# EAGLE schematic PSU (EAGLE 9.2.2)
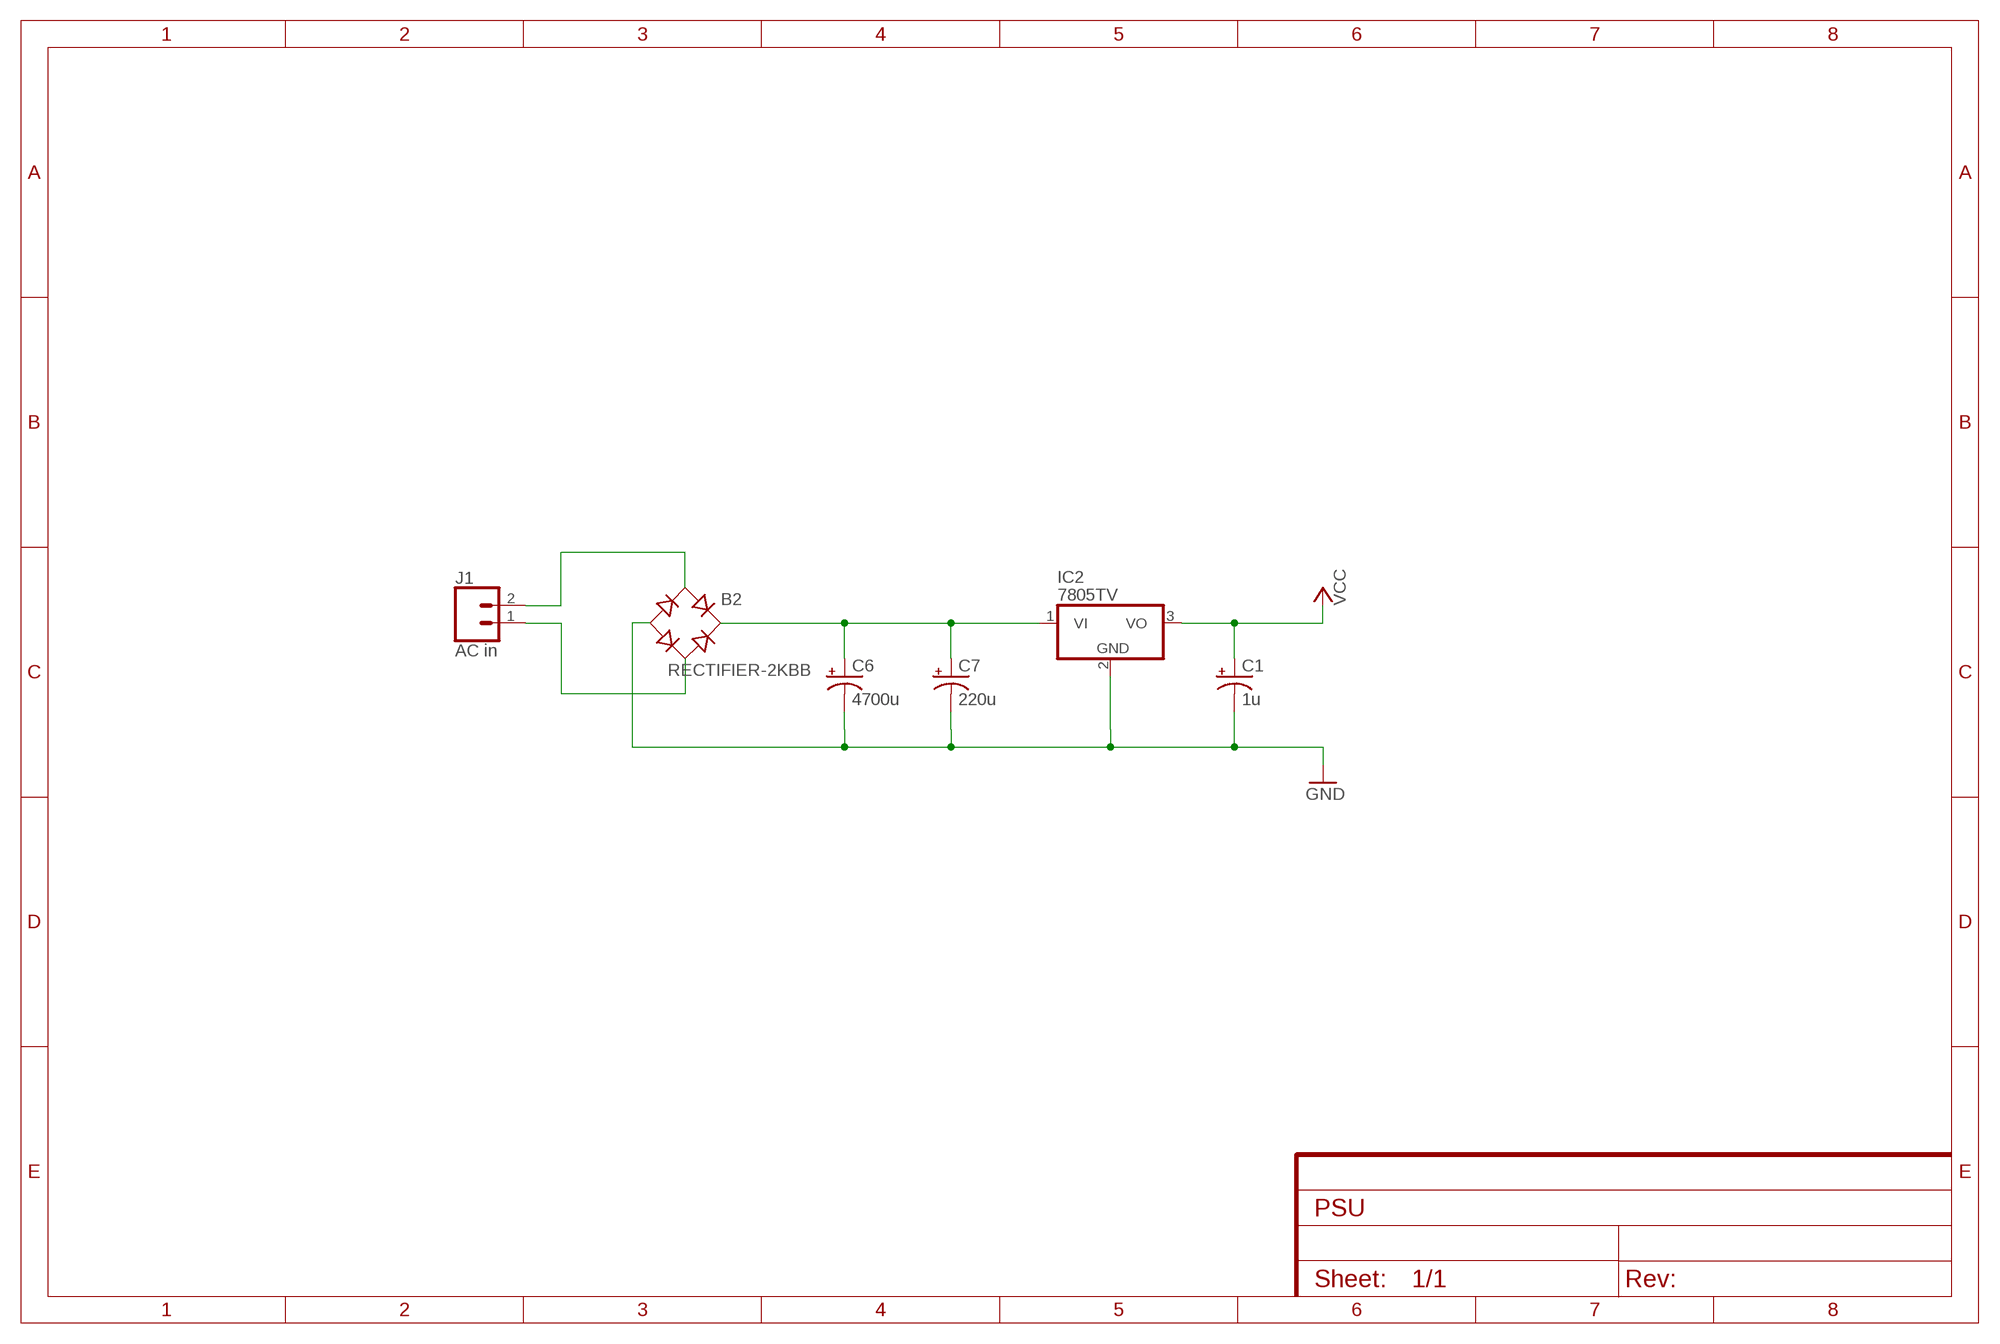
[diagram p0: schematic, sheet 1]

## Parts
B2  RECTIFIER-2KBB  [2KBB]
C1  1u  CPOL-USE2.5-5  [E2,5-5]
C6  4700u  CPOL-USE7.5-16  [E7,5-16]
C7  220u  CPOL-USE2.5-6  [E2,5-6]
IC2  7805TV  [TO220V]
J1  AC in  CONN_02  [1X02]

## Nets
GND [power]: B2.- C1.- C6.- C7.- IC2.2(GND)
N$105 [power]: B2.AC1 J1.2
N$107 [power]: B2.AC2 J1.1
N$108 [power]: B2.+ C6.+ C7.+ IC2.1(VI)
VCC [power]: C1.+ IC2.3(VO)

## Library data of the parts
B2 = rectifier:RECTIFIER-: Rectifier
C1 C6 C7 = adafruit:CPOL-US: POLARIZED CAPACITOR, American symbol
IC2 = linear:78*: Positive VOLTAGE REGULATOR Source: http://cache.national.com/ds/LM/LM78L05.pdf http://www.fairchildsemi.com/ds/LM/LM7805.pdf
J1 = SparkFun-Connectors:CONN_02: Multi connection point. Often used as Generic Header-pin footprint for 0.1 inch spaced/style header connections On any of the 0.1 inch spaced packages, you can populate with these: Break Away Headers - Straight <https://www.sparkfun.com/products/116> (PRT-00116) Break Away Male Headers - Right Angle <https://www.sparkfun.com/products/553> (PRT-00553) Female Headers <https://www.sparkfun.com/products/115> (PRT-00115) Break Away Headers - Machine Pin <https://www.sparkfun.com/products/117> (PRT-00117) Break Away Female Headers - Swiss Machine Pin <https://www.sparkfun.com/products/743> (PRT-00743) For SCREWTERMINALS and SPRING TERMINALS visit here: Screw Terimnals on SparkFun.com <https://www.sparkfun.com/search/results?term=Screw+Terminals> (5mm/3.5mm/2.54mm spacing) This device is also useful as a general connection point to wire up your design to another part of your project. Our various solder wires solder well into these plated through hole pads. Hook-Up Wire - Assortment (Stranded, 22 AWG) <https://www.sparkfun.com/products/11375> (PRT-11375) Hook-Up Wire - Assortment (Solid Core, 22 AWG) <https://www.sparkfun.com/products/11367> (PRT-11367) View the entire wire category on our website here <https://www.sparkfun.com/categories/141> Special notes: Molex polarized connector foot print use with: PRT-08233 with associated crimp pins and housings. 2.54_SCREWTERM for use with PRT-10571. 3.5mm Screw Terminal footprints for PRT-08084 5mm Screw Terminal footprints for use with PRT-08432

## Net classes
1 power: width 0.254 mm